# Altium project Mach dieu khien van toc dong co dc.PrjPCB
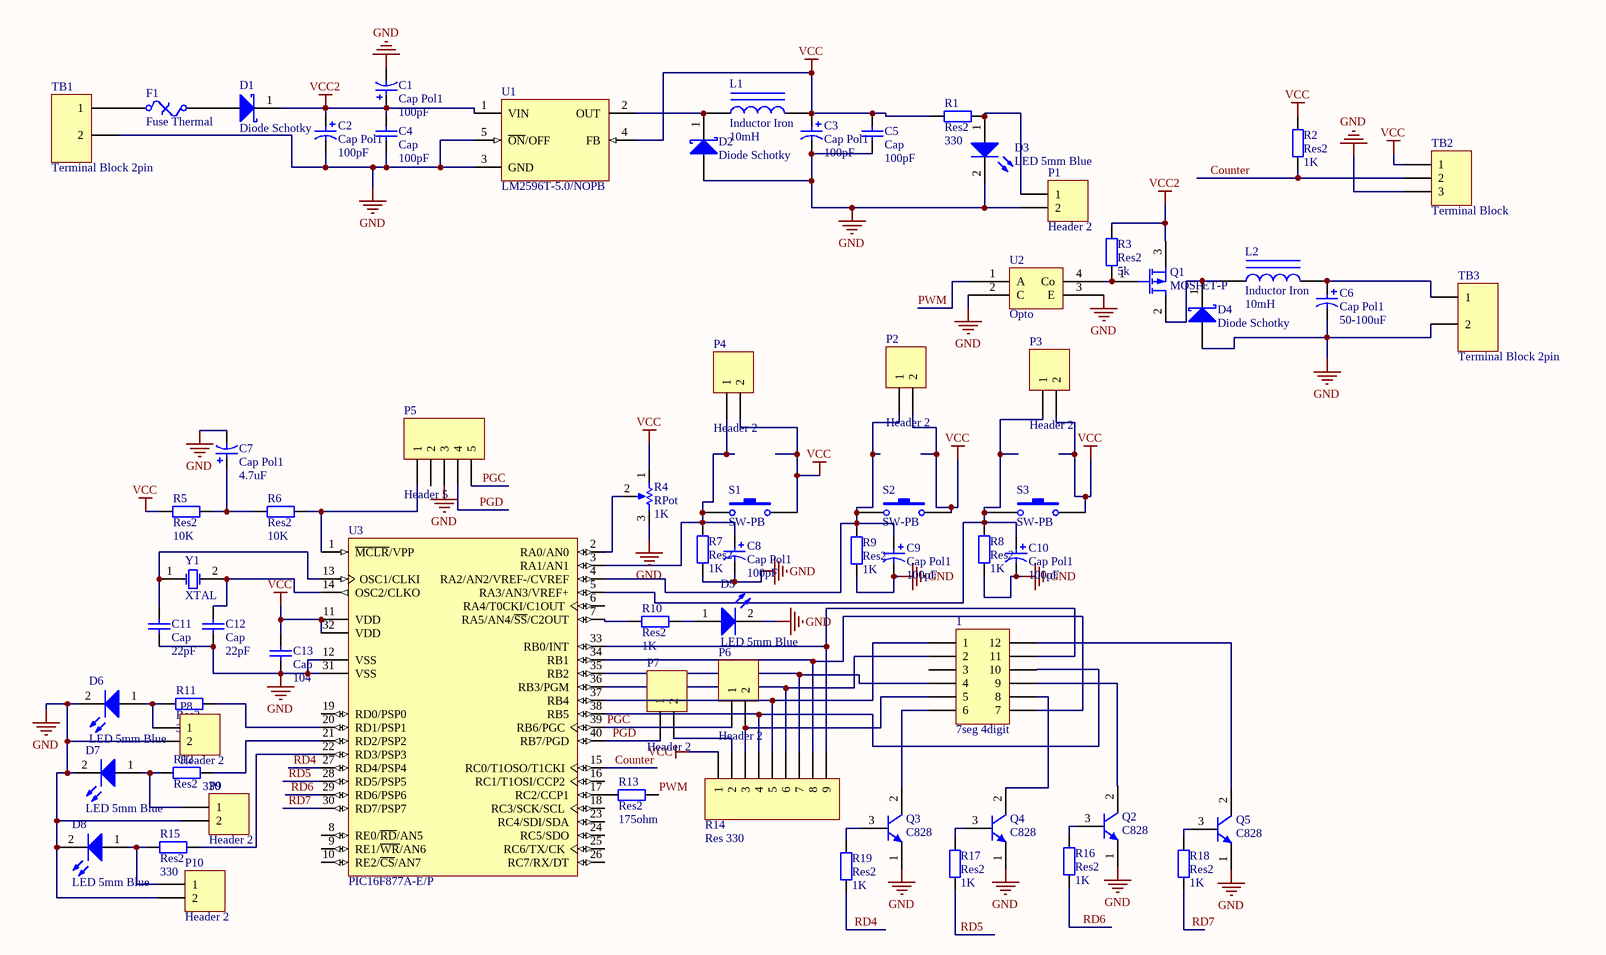
[diagram p0: Mach dieu khien dong co dc.SchDoc]
1 sheet, 69 parts. Net scope: global (net labels, ports and power ports of the same name join across sheets).
Board file: Mach dieu khien dong co dc.PcbDoc

## Sheet Mach dieu khien dong co dc.SchDoc
size A3

### Parts
1  7seg 4digit  [LEDDIP-12/QUAD]
C1  Cap Pol1  value 100pF  [CAPPR2-5x7]
C2  Cap Pol1  value 100pF  [CAPPR2.5-6.3x5/H.9]
C3  Cap Pol1  value 100pF  [CAPPR2.5-6.3x5/H.9]
C4  Cap  value 100pF  [CAPNTO3.18-4.83x2.67]
C5  Cap  value 100pF  [CAPNTO3.18-4.83x2.67]
C6  Cap Pol1  value 50-100uF  [CAPPR2.5-6.3x5/H.9]
C7  Cap Pol1  value 4.7uF  [CAPPR2-5x7]
C8  Cap Pol1  value 100pF  [CAPPR2-5x7]
C9  Cap Pol1  value 100pF  [CAPPR2-5x7]
C10  Cap Pol1  value 100pF  [CAPPR2-5x7]
C11  Cap  value 22pF  [CAPNTO3.18-4.83x2.67]
C12  Cap  value 22pF  [CAPNTO3.18-4.83x2.67]
C13  Cap  value 104  [CAPNTO3.18-4.83x2.67]
D1  Diode Schotky  [DO-201AD]
D2  Diode Schotky  [DO-41]
D3  LED 5mm Blue  [LED 5mm Blue]
D4  Diode Schotky  [DO-41]
D5  LED 5mm Blue  [LED 5mm Blue]
D6  LED 5mm Blue  [LED 5mm Blue]
D7  LED 5mm Blue  [LED 5mm Blue]
D8  LED 5mm Blue  [LED 5mm Blue]
F1  Fuse Thermal  [PIN-W2/E2.8 -Manh]
L1  Inductor Iron  value 10mH  [Inductor power]
L2  Inductor Iron  value 10mH  [Inductor power]
P1  Header 2  [HDR1X2]
P2  Header 2  [HDR1X2]
P3  Header 2  [HDR1X2]
P4  Header 2  [HDR1X2]
P5  Header 5  [HDR1X5]
P6  Header 2  [HDR1X2]
P7  Header 2  [HDR1X2]
P8  Header 2  [HDR1X2]
P9  Header 2  [HDR1X2]
P10  Header 2  [HDR1X2]
Q1  MOSFET-P  [TO 220]
Q2  C828  [TO-92-manh]
Q3  C828  [TO-92-manh]
Q4  C828  [TO-92-manh]
Q5  C828  [TO-92-manh]
R1  Res2  value 330  [AXIAL-0.4]
R2  Res2  value 1K  [AXIAL-0.4]
R3  Res2  value 5k  [AXIAL-0.4]
R4  RPot  value 1K  [Variable Resistor]
R5  Res2  value 10K  [AXIAL-0.4]
R6  Res2  value 10K  [AXIAL-0.4]
R7  Res2  value 1K  [AXIAL-0.4]
R8  Res2  value 1K  [AXIAL-0.4]
R9  Res2  value 1K  [AXIAL-0.4]
R10  Res2  value 1K  [AXIAL-0.4]
R11  Res2  value 330  [AXIAL-0.4]
R12  Res2  value 330  [AXIAL-0.4]
R13  Res2  value 175ohm  [AXIAL-0.4]
R14  Res 330  [Res array 8]
R15  Res2  value 330  [AXIAL-0.4]
R16  Res2  value 1K  [AXIAL-0.4]
R17  Res2  value 1K  [AXIAL-0.4]
R18  Res2  value 1K  [AXIAL-0.4]
R19  Res2  value 1K  [AXIAL-0.4]
S1  SW-PB  [Button DIP4]
S2  SW-PB  [Button DIP4]
S3  SW-PB  [Button DIP4]
TB1  Terminal Block 2pin  [Screw Terminal Block 2pin 5mm]
TB2  Terminal Block  [Screw Terminal Block 3pin 5mm]
TB3  Terminal Block 2pin  [Screw Terminal Block 2pin 5mm]
U1  LM2596T-5.0/NOPB  [T05D]
U2  Opto  [DIP-6 -v2]
U3  PIC16F877A-E/P  [PDIP600-40]
Y1  XTAL  [R38]

### Nets
GND: C1.2 C2.2 C3.2 C4.1 C5.1 C6.2 C7.2 C8.2 C9.2 C10.2 C11.1 C12.1 C13.1 D2.2(A) D3.2(K) D4.2(A) D5.2(K) D6.2(K) D7.2(K) D8.2(K) P1.2 P5.3 P8.2 P9.2 P10.2 Q2.1(E) Q3.1(E) Q4.1(E) Q5.1(E) R4.3(BOT) R7.1 R8.1 R9.1 TB1.2 TB2.3 TB3.2 U1.3(GND) U1.5(~{ON}/OFF) U2.2(C) U2.3(E) U3.12(VSS) U3.31(VSS)
VCC: C3.1 C5.2 C13.2 L1.2 P2.2 P3.2 P4.2 R1.1 R2.1 R4.1(TOP) R5.1 R14.1 S1.2 S2.2 S3.2 TB2.1 U1.4(FB) U3.11(VDD) U3.32(VDD)
VCC2: C1.1 C2.1 C4.2 D1.1(K) Q1.3(S) R3.2 U1.1(VIN)
Counter: R2.2 TB2.2 U3.15(RC0/T1OSO/T1CKI)
PGC: P5.5 P6.1 U3.39(RB6/PGC)
PGD: P5.4 P7.1 U3.40(RB7/PGD)
PWM: R13.1 U2.1(A)
RD4: R19.1 U3.27(RD4/PSP4)
RD5: R17.1 U3.28(RD5/PSP5)
RD6: R16.1 U3.29(RD6/PSP6)
RD7: R18.1 U3.30(RD7/PSP7)
Net1_1: 1.1 R14.5 U3.37(RB4)
Net1_2: 1.2 R14.6 U3.36(RB3/PGM)
Net1_4: 1.4 R14.7 U3.35(RB2)
Net1_5: 1.5 P6.2 R14.3
Net1_6: 1.6 Q3.2(C)
Net1_7: 1.7 R14.8 U3.34(RB1)
Net1_8: 1.8 Q4.2(C)
Net1_9: 1.9 Q2.2(C)
Net1_10: 1.10 R14.4 U3.38(RB5)
Net1_11: 1.11 R14.9 U3.33(RB0/INT)
Net1_12: 1.12 Q5.2(C)
NetC6_1: C6.1 L2.2 TB3.1
NetC7_1: C7.1 R5.2 R6.1
NetC8_1: C8.1 P4.1 R7.2 S1.1 U3.3(RA1/AN1)
NetC9_1: C9.1 P2.1 R9.2 S2.1 U3.4(RA2/AN2/VREF-/CVREF)
NetC10_1: C10.1 P3.1 R8.2 S3.1 U3.5(RA3/AN3/VREF+)
NetC11_2: C11.2 U3.13(OSC1/CLKI) Y1.1(OSC1)
NetC12_2: C12.2 U3.14(OSC2/CLKO) Y1.2(OSC2)
NetD1_2: D1.2(A) F1.2
NetD2_1: D2.1(K) L1.1 U1.2(OUT)
NetD3_1: D3.1(A) P1.1 R1.2
NetD4_1: D4.1(K) L2.1 Q1.2(D)
NetD5_1: D5.1(A) R10.2
NetD6_1: D6.1(A) P8.1 R11.1
NetD7_1: D7.1(A) P9.1 R12.1
NetD8_1: D8.1(A) P10.1 R15.1
NetF1_1: F1.1 TB1.1
NetP5_1: P5.1 R6.2 U3.1(~{MCLR}/VPP)
NetP7_2: P7.2 R14.2
NetQ1_1: Q1.1(G) R3.1 U2.4(Co)
NetQ2_3: Q2.3(B) R16.2
NetQ3_3: Q3.3(B) R19.2
NetQ4_3: Q4.3(B) R17.2
NetQ5_3: Q5.3(B) R18.2
NetR4_2: R4.2(TAP) U3.2(RA0/AN0)
NetR10_1: R10.1 U3.7(RA5/AN4/~{SS}/C2OUT)
NetR11_2: R11.2 U3.20(RD1/PSP1)
NetR12_2: R12.2 U3.21(RD2/PSP2)
NetR13_2: R13.2 U3.17(RC2/CCP1)
NetR15_2: R15.2 U3.22(RD3/PSP3)

Not connected (* = marked no-connect by the designer): 1 3; P5 2; U3 6(RA4/T0CKI/C1OUT) 8(RE0/~{RD}/AN5) 9(RE1/~{WR}/AN6) 10(RE2/~{CS}/AN7) 16(RC1/T1OSI/CCP2) 18(RC3/SCK/SCL) 19(RD0/PSP0) 23(RC4/SDI/SDA) 24(RC5/SDO) 25(RC6/TX/CK) 26(RC7/RX/DT)

### Library data of the parts
1 = 7seg 4digit: Header, 6-Pin, Dual row; LatestRevisionDate: 17-Jul-2002; LatestRevisionNote: Re-released for DXP Platform.; Publisher: Altium Limited
C1-C3 C6-C10 = Cap Pol1: Polarized Capacitor (Radial); Published: 8-Jun-2000; LatestRevisionDate: 17-Jul-2002; LatestRevisionNote: Re-released for DXP Platform.; PackageReference: RB7.6-15; Publisher: Altium Limited; PackageDescription: Polarized Capacitor (Radial); 2 Leads
C4 C5 C11-C13 = Cap: Capacitor; Published: 8-Jun-2000; LatestRevisionDate: 17-Jul-2002; LatestRevisionNote: Re-released for DXP Platform.; PackageReference: RAD-0.3; Publisher: Altium Limited; PackageDescription: Radial Cap, Thru-Hole; 2 Leads; 0.3 in Pin Spacing
D1 D2 D4 = Diode Schotky: Schottky Rectifier; Note: Terminal 2 is the TAB and is electrically connected to the cathode; Published: 8-Jun-2000; LatestRevisionDate: 17-Jul-2002; LatestRevisionNote: Re-released for DXP Platform.; DatasheetVersion: PD-2.057B; PackageVersion: Feb-1998; PackageReference: TO-220AC; Publisher: Altium Limited; PackageDescription: TO, Thru-Hole, Vertical, Heatsink Mounted; 3 In-Line Leads (1 Absent); Pitch 2.54 mm; ComponentLink1Description: Manufacturer Link; ComponentLink1URL: http://www.irf.com/; ComponentLink2Description: Datasheet; ComponentLink2URL: http://www.irf.com/product-info/datasheets/data/10tq.pdf
D3 D5-D8 = LED 5mm Blue: Typical INFRARED GaAs LED; Published: 8-Jun-2000; LatestRevisionDate: 08-Jul-2005; LatestRevisionNote: Mech Layer 1 removed.; PackageReference: LED-0; Publisher: Altium Limited; PackageDescription: LED; 2 Leads
F1 = Fuse Thermal: Thermal Fuse; Published: 24-Mar-1999; LatestRevisionDate: 17-Jul-2002; LatestRevisionNote: Re-released for DXP Platform.; PackageReference: PIN-W2/E2.8; Publisher: Altium Limited; PackageDescription: Thru-Hole; 2 Leads
L1 L2 = Inductor Iron: Magnetic-Core Inductor; Published: 24-Mar-1999; LatestRevisionDate: 17-Jul-2002; LatestRevisionNote: Re-released for DXP Platform.; PackageReference: AXIAL-0.9; Publisher: Altium Limited; PackageDescription: Axial Device, Thru-Hole; 2 Leads; 0.9 in Pin Spacing
P1-P4 P6-P10 = Header 2: Header, 2-Pin; LatestRevisionDate: 17-Jul-2002; LatestRevisionNote: Re-released for DXP Platform.; Publisher: Altium Limited
P5 = Header 5: Header, 5-Pin; LatestRevisionDate: 17-Jul-2002; LatestRevisionNote: Re-released for DXP Platform.; Publisher: Altium Limited
Q1 = MOSFET-P: P-Channel MOSFET; Published: 8-Jun-2000; LatestRevisionDate: 17-Jul-2002; LatestRevisionNote: Re-released for DXP Platform.; PackageVersion: 1995/1996; PackageReference: E3; Publisher: Altium Limited; PackageDescription: TO, Flat Index; 3 In-Line, Axial Leads; Body Dia. 4.6mm; Lead Dia. 0.5 mm (max)
Q2-Q5 = C828: NPN General Purpose Amplifier; Published: 8-Jun-2000; LatestRevisionDate: 15-Jan-2003; LatestRevisionNote: PCB Footprint 'BCY-W3/D4.7' replaced; DatasheetVersion: 1997; PackageVersion: Sep-1998; PackageReference: TO-92A; Publisher: Altium Limited; PackageDescription: TO, Flat Index; 3 In-Line, Axial Leads; Body Dia. 4.5mm; Leads 0.51 x 0.48 mm (max); ComponentLink1Description: Manufacturer Link; ComponentLink1URL: http://www.fairchildsemi.com/; ComponentLink2Description: Datasheet; ComponentLink2URL: http://www.fairchildsemi.com/ds/2N%2F2N3904.pdf
R1-R3 R5-R13 R15-R19 = Res2: Resistor; Published: 8-Jun-2000; LatestRevisionDate: 17-Jul-2002; LatestRevisionNote: Re-released for DXP Platform.; PackageReference: AXIAL-0.4; Publisher: Altium Limited; PackageDescription: Axial Device, Thru-Hole; 2 Leads; 0.4 in Pin Spacing
R4 = RPot: Potentiometer; Sim Note: Enter the Resistance value and the set point into parameter fields.; Set Position: 0.5; Published: 8-Jun-2000; LatestRevisionDate: 17-Jul-2002; LatestRevisionNote: Re-released for DXP Platform.; PackageReference: VR5; Publisher: Altium Limited; PackageDescription: Variable Resistor, Thru-Hole; 3 Leads
R14 = Res array 8: Header, 9-Pin; LatestRevisionDate: 17-Jul-2002; LatestRevisionNote: Re-released for DXP Platform.; Publisher: Altium Limited
S1-S3 = SW-PB: Switch; Published: 24-Mar-1999; LatestRevisionDate: 17-Jul-2002; LatestRevisionNote: Re-released for DXP Platform.; PackageReference: SPST-2; Publisher: Altium Limited; PackageDescription: Switch; 2 Leads
TB2 = Terminal Block 3pin: LatestRevisionDate: 17-Jul-2002; LatestRevisionNote: Re-released for DXP Platform.; Publisher: Altium Limited
U1 = LM2596T-5.0/NOPB: SIMPLE SWITCHER® Power Converter 150 KHz 3A Step-Down Voltage Regulator, 5-pin TO-220, Pb-Free; Manufacturer: National Semiconductor; PackageTopMarking: NSUZXYTTE#*LM2596T*-5.0 P+; PowerWise: N; Published: 1-Mar-2010; DatasheetVersion: May-2002; PackageVersion: revA, Oct-1989; PackageReference: T05D; Publisher: Altium Limited; PackageDescription: TO-220, Molded, Stagger Bend, 5 Lead; Supplier 1: Digi-Key; Supplier Part Number 1: LM2596T-5.0-ND; Supplier 2: Farnell; Supplier Part Number 2: 1150103; PartNumber: LM2596T-5.0/NOPB; RoHS: Y; PinCount: 5; CompType: Switcher; ComponentLink1Description: LM2596 Datasheet; ComponentLink1URL: http://www.national.com/ds/LM/LM2596.pdf; ComponentLink2Description: LM2596 Web Page; ComponentLink2URL: http://www.national.com/pf/LM/LM2596.html; ComponentLink3Description: T05D Package Page; ComponentLink3URL: http://www.national.com/packaging/folders/t05d.html
U2 = Opto 1
U3 = PIC16F877A-E/P: Enhanced FLASH Microcontroller, 8K (x14-Bit words) FLASH, 368 Bytes RAM, 40-Pin PDIP, Standard VDD Range, Extended Temperature; ComponentAvailability: Unknown. Contact manufacturer to determine status.; Published: 11-Oct-2004; LatestRevisionDate: 29-Jan-2009; LatestRevisionNote: Sch. layout revised. 3D Model Removed.; DatasheetVersion: revB, Oct-2003; PackageVersion: revBB, Aug-2009; PackageReference: PDIP600-P40; Publisher: Altium Limited; PackageDescription: 40-Lead Plastic Dual In-Line (P) - 600 mil Body [PDIP]; Supplier 1: Digi-Key; Supplier Part Number 1: PIC16F877A-E/P-ND; Supplier 2: Farnell; Supplier Part Number 2: 1567990; ComponentLink1Description: Datasheet; ComponentLink1URL: http://ww1.microchip.com/downloads/en/DeviceDoc/39582b.pdf; ComponentLink2Description: Packaging Specification; ComponentLink2URL: http://www.microchip.com/stellent/groups/techpub_sg/documents/packagingspec/en012702.pdf; ComponentLink3Description: Microchip.com Home; ComponentLink3URL: http://www.microchip.com/
Y1 = XTAL: Crystal Oscillator; Published: 8-Jun-2000; LatestRevisionDate: 17-Jul-2002; LatestRevisionNote: Re-released for DXP Platform.; PackageReference: R38; Publisher: Altium Limited; PackageDescription: Crystal, Thru-Hole; 2 Leads; Body 3.1 x 8.2 mm (Dia.xH)
TB1 TB3 = Terminal Block 2pin: LatestRevisionDate: 17-Jul-2002; LatestRevisionNote: Re-released for DXP Platform.; Publisher: Altium Limited